# Altium schematic sheet motor driver.SchDoc: Wprowadź Tytuł
size A4; CheckedBy: Wprowadź sprawdzającego; DrawnBy: Wprowadź autora; Organization: Koło Naukowe Robotyków; Address1: Nowowiejska 24; Address2: 00-001; Address3: Wraszawa; Address4: Polska; Revision: Numer; Nazwa Arkusza: Wpisz nazwę arkusza; ProjectName: Nazwa Projektu
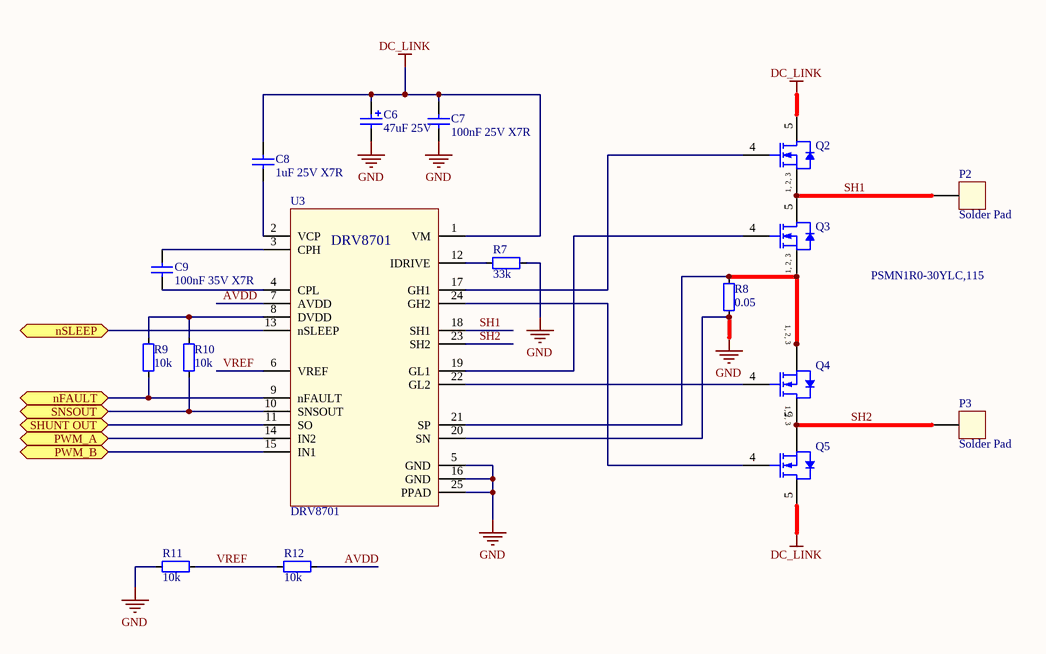
[diagram p0: motor driver.SchDoc]

## Parts
C6  47uF 25V  [ELECTROLYTIC 5mm]
C7  100nF 25V X7R  [CAP_0603]
C8  1uF 25V X7R  [CAP_0603]
C9  100nF 35V X7R  [CAP_0603]
P2  Solder Pad  [Solder Pad 6x8]  (no BOM)
P3  Solder Pad  [Solder Pad 6x8]  (no BOM)
Q2  PSMN1R0-30YLC,115  [NXP-SOT669_N]
Q3  PSMN1R0-30YLC,115  [NXP-SOT669_N]  (value not drawn)
Q4  PSMN1R0-30YLC,115  [NXP-SOT669_N]  (value not drawn)
Q5  PSMN1R0-30YLC,115  [NXP-SOT669_N]  (value not drawn)
R7  33k  [RES_0603]
R8  0.05  [CSS2H-2512]
R9  10k  [RES_0603]
R10  10k  [RES_0603]
R11  10k  [RES_0603]
R12  10k  [RES_0603]
U3  DRV8701  [VQFN24]

## Ports
nFAULT, nSLEEP, PWM_A, PWM_B, SHUNT OUT, SNSOUT

## Nets
DC_LINK: C6.1 C7.2 C8.2 Q2.5(D) Q5.5(D) U3.1(VM)
GND: C6.2 C7.1 R7.2 R8.1 R11.2 U3.5(GND) U3.16(GND) U3.20(SN) U3.25(PPAD)
AVDD: R12.1 U3.7(AVDD)
nFAULT: R9.1 U3.9(nFAULT) ; port nFAULT
nSLEEP: U3.13(nSLEEP) ; port nSLEEP
PWM_A: U3.14(IN2) ; port PWM_A
PWM_B: U3.15(IN1) ; port PWM_B
SH1: P2.1 Q2.1(S) Q2.2(S) Q2.3(S) Q3.5(D) U3.18(SH1)
SH2: P3.1 Q4.5(D) Q5.1(S) Q5.2(S) Q5.3(S) U3.23(SH2)
SHUNT OUT: U3.11(SO) ; port SHUNT OUT
SNSOUT: R10.1 U3.10(SNSOUT) ; port SNSOUT
VREF: R11.1 R12.2 U3.6(VREF)
NetC8_1: C8.1 U3.2(VCP)
NetC9_1: C9.1 U3.4(CPL)
NetC9_2: C9.2 U3.3(CPH)
NetQ2_4: Q2.4(G) U3.17(GH1)
NetQ3_1: Q3.1(S) Q3.2(S) Q3.3(S) Q4.1(S) Q4.2(S) Q4.3(S) R8.2 U3.21(SP)
NetQ3_4: Q3.4(G) U3.19(GL1)
NetQ4_4: Q4.4(G) U3.22(GL2)
NetQ5_4: Q5.4(G) U3.24(GH2)
NetR7_1: R7.1 U3.12(IDRIVE)
NetR9_2: R9.2 R10.2 U3.8(DVDD)

## Notes on the sheet
- Narysował
- Sprawdził
- Projekt
- Date:
- Wersja
- Plik
- (in symbol PSMN1R0-30YLC,115) 1, 2, 3

## Library data of the parts
C6 = Electrolytic: Electrolytic capacitor; Value: 47uF 25V
C7-C9 = Ceramic: AEC Ceramic capacitor X7R
  C7: Value: 100nF 25V X7R
  C8: Value: 1uF 25V X7R
  C9: Value: 100nF 35V X7R
Q2-Q5 = PSMN1R0-30YLC,115: N-Channel Logic Level MOSFET Using NextPower Technology, 30 V, 100 A, 5-Pin SOT669, Tape and Reel; Manufacturer: NXP Semiconductors; Channel Type: N; Ciss [typ] (pF): 6645; Coss [typ] (pF): 1210; ID [max] (A): 100; Packing: Tape & Reel; Qr [typ] (nC): 67; VDS [max] (V): 30; VGSth [typ] (V): 1.41; DatasheetVersion: Rev. 4; PackageVersion: 13-02-27, 02/2013; PackageReference: SOT669; PackageDescription: 4-Pin Plastic Single-ended Surface Mounted Package, Body 4.9 x 3.95 mm, Pitch 1.27 mm; Supplier 1: Digi-Key; Supplier Part Number 1: 568-6721-2-ND; Supplier 2: Digi-Key; Supplier Part Number 2: 568-6721-1-ND; Supplier 3: Digi-Key; Supplier Part Number 3: 568-6721-6-ND; Supplier 4: Newark; Supplier Part Number 4: 41T4402; Supplier 5: Mouser; Supplier Part Number 5: 771-PSMN1R0-30YLC115; Mounting Technology: Surface Mount; Code_JEDEC: MO-235; PartNumber: PSMN1R0-30YLC,115; ComponentLink1Description: Manufacturer URL; ComponentLink1URL: http://www.nxp.com/; ComponentLink2Description: Datasheet; ComponentLink2URL: http://www.nxp.com/documents/data_sheet/PSMN1R0-30YLC.pdf; ComponentLink3Description: Package Specification; ComponentLink3URL: http://www.nxp.com/documents/outline_drawing/sot669_po.pdf
R7 R9-R12 = Resistor: Default resistor; Value: 1k
R8 = CSS2H-2512R-L500F: AEC 500uOm 6W precision current sense resistor; producent: bourns; Value: 0.05; part_number: CSS2H-2512R-L500F
U3 = DRV8701: helpURL: http://www.ti.com/lit/ds/symlink/drv8701.pdf